# Altium schematic sheet icamlamp_evo.SchDoc
size A4
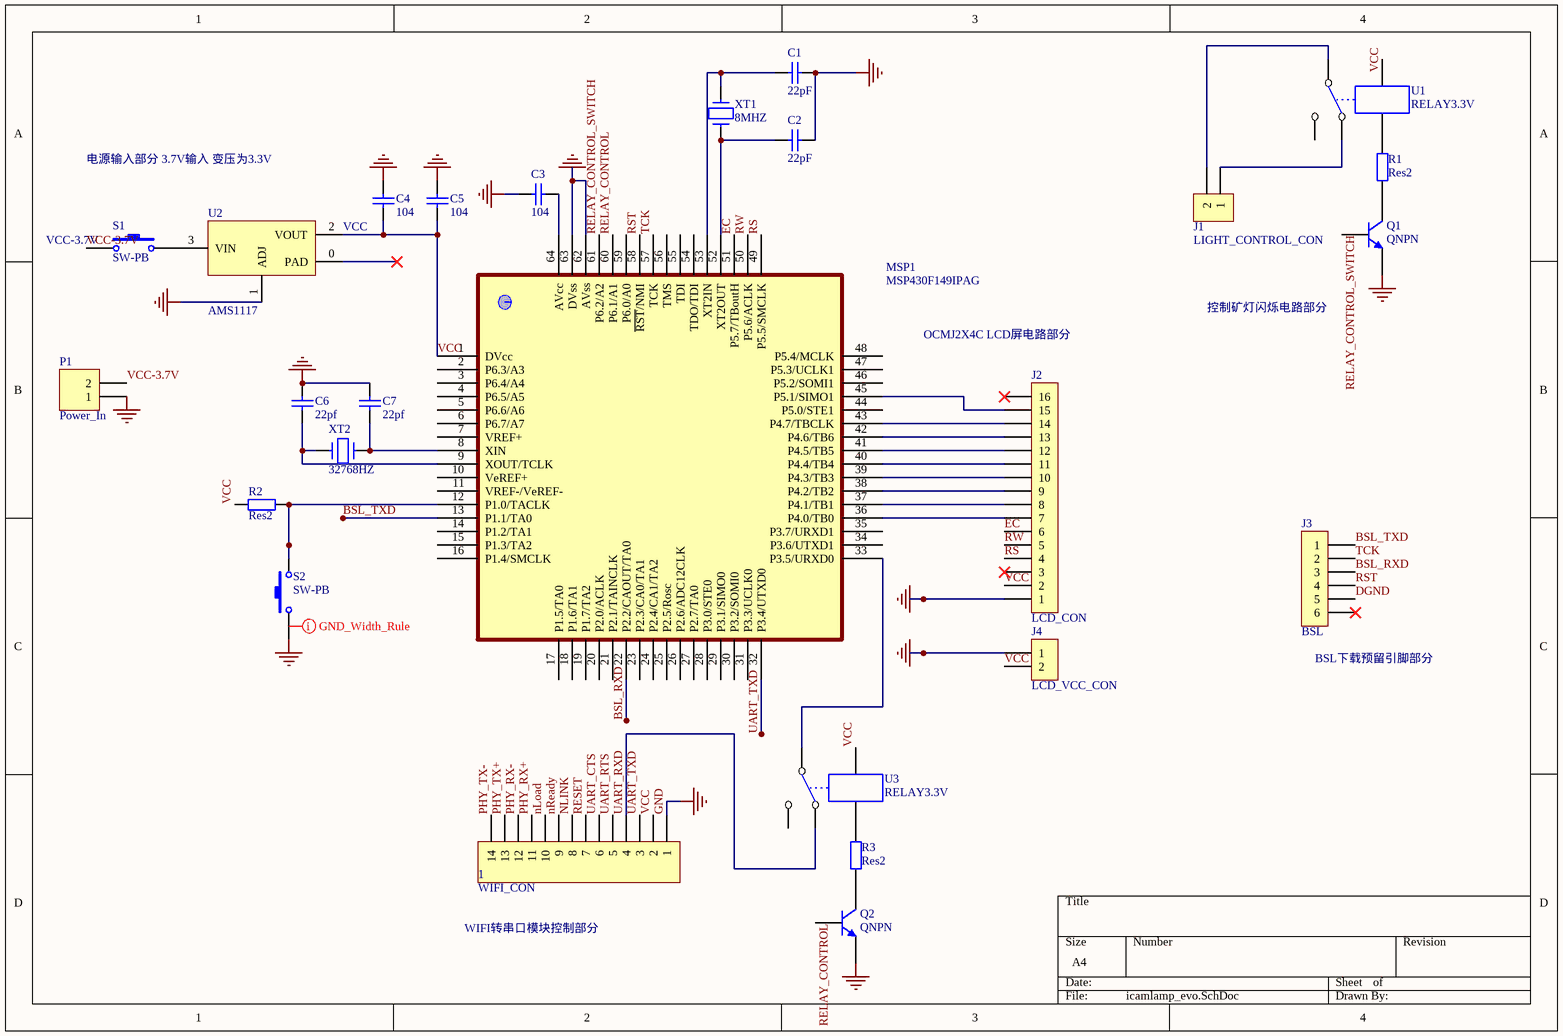
[diagram p0: icamlamp_evo.SchDoc]

## Parts
1  WIFI_CON  [wificon]
C1  22pF  [0805]
C2  22pF  [0805]
C3  104  [0805]
C4  104  [0805]
C5  104  [0805]
C6  22pf  [0805]
C7  22pf  [0805]
J1  LIGHT_CONTROL_CON  [SIP2]
J2  LCD_CON  [HDR2X8]
J3  BSL  [HDR2X3]
J4  LCD_VCC_CON  [SIP2]
MSP1  MSP430F149IPAG  [PAG]
P1  Power_In  [HDR1X2H]
Q1  QNPN  [SO-G3/C2.5]
Q2  QNPN  [SO-G3/C2.5]
R1  Res2  [0805]
R2  Res2  [0805]
R3  Res2  [0805]
S1  SW-PB  [SPST-2]
S2  SW-PB  [SPST-2]
U1  RELAY3.3V  [Relay5V]
U2  AMS1117  [SOT-223]
U3  RELAY3.3V  [Relay5V]
XT1  8MHZ  [HC-49S]
XT2  32768HZ  [AT26]

## Nets
GND: 1.1 C1.1 C2.1 C3.2 C4.1 C5.1 C6.2 C7.2 J2.1 J4.1 MSP1.62(AVss) MSP1.63(DVss) P1.1 Q1.3(E) Q2.3(E) S2.1 U2.1(ADJ)
BSL_RXD: J3.3 MSP1.22(P2.2/CAOUT/TA0)
BSL_TXD: J3.1 MSP1.13(P1.1/TA0)
DGND: J3.5
EC: J2.6 MSP1.51(P5.7/TBoutH)
NLINK: 1.8
nLoad: 1.10
nReady: 1.9
PHY_RX+: 1.11
PHY_RX-: 1.12
PHY_TX+: 1.13
PHY_TX-: 1.14
RELAY_CONTROL: MSP1.60(P6.1/A1) Q2.2(B)
RELAY_CONTROL_SWITCH: MSP1.61(P6.2/A2) Q1.2(B)
RESET: 1.7
RS: J2.4 MSP1.49(P5.5/SMCLK)
RST: J3.4 MSP1.58(~{RST}/NMI)
RW: J2.5 MSP1.50(P5.6/ACLK)
TCK: J3.2 MSP1.57(TCK)
UART_CTS: 1.6
UART_RTS: 1.5
UART_RXD: 1.4 U3.3
UART_TXD: 1.3 MSP1.32(P3.4/UTXD0)
VCC: 1.2 C4.2 C5.2 J2.2 J4.2 MSP1.1(DVcc) R2.1 U2.2(VOUT) U3.4
VCC-3.7V: P1.2 S1.1
NetC1_2: C1.2 MSP1.53(XT2IN) XT1.2
NetC2_2: C2.2 MSP1.52(XT2OUT) XT1.1
NetC3_1: C3.1 MSP1.64(AVcc)
NetC6_1: C6.1 MSP1.9(XOUT/TCLK) XT2.2
NetC7_1: C7.1 MSP1.8(XIN) XT2.1
NetJ1_1: J1.1 U1.3
NetJ1_2: J1.2 U1.1
NetJ2_7: J2.7 MSP1.36(P4.0/TB0)
NetJ2_8: J2.8 MSP1.37(P4.1/TB1)
NetJ2_9: J2.9 MSP1.38(P4.2/TB2)
NetJ2_10: J2.10 MSP1.39(P4.3/TB3)
NetJ2_11: J2.11 MSP1.40(P4.4/TB4)
NetJ2_12: J2.12 MSP1.41(P4.5/TB5)
NetJ2_13: J2.13 MSP1.42(P4.6/TB6)
NetJ2_14: J2.14 MSP1.43(P4.7/TBCLK)
NetJ2_15: J2.15 MSP1.45(P5.1/SIMO1)
NetMSP1_12: MSP1.12(P1.0/TACLK) R2.2 S2.2
NetMSP1_33: MSP1.33(P3.5/URXD0) U3.1
NetQ1_1: Q1.1(C) R1.1
NetQ2_1: Q2.1(C) R3.1
NetR1_2: R1.2 U1.5
NetR3_2: R3.2 U3.5
NetS1_2: S1.2 U2.3(VIN)

Not connected (* = marked no-connect by the designer): J2 3* 16*; J3 6*; MSP1 2(P6.3/A3) 3(P6.4/A4) 4(P6.5/A5) 5(P6.6/A6) 6(P6.7/A7) 7(VREF+) 10(VeREF+) 11(VREF-/VeREF-) 14(P1.2/TA1) 15(P1.3/TA2) 16(P1.4/SMCLK) 17(P1.5/TA0) 18(P1.6/TA1) 19(P1.7/TA2) 20(P2.0/ACLK) 21(P2.1/TAINCLK) 23(P2.3/CA0/TA1) 24(P2.4/CA1/TA2) 25(P2.5/Rosc) 26(P2.6/ADC12CLK) 27(P2.7/TA0) 28(P3.0/STE0) 29(P3.1/SIMO0) 30(P3.2/SOMI0) 31(P3.3/UCLK0) 34(P3.6/UTXD1) 35(P3.7/URXD1) 44(P5.0/STE1) 46(P5.2/SOMI1) 47(P5.3/UCLK1) 48(P5.4/MCLK) 54(TDO/TDI) 55(TDI) 56(TMS) 59(P6.0/A0); U1 2 4; U2 0(PAD)*; U3 2

## Layout directives
rule Width Constraint [Pref Width = 30mil    Min Width = 30mil    Max Width = 30mil]: (no net found under the mark)

## Notes on the sheet
- 电源输入部分 3.7V输入 变压为3.3V
- (near S1) VCC-3.7V
- VCC
- 控制矿灯闪烁电路部分
- OCMJ2X4C LCD屏电路部分
- (near J3) BSL下载预留引脚部分
- WIFI转串口模块控制部分
- Labels drawn without touching a wire or pin: VCC

## Library data of the parts
1 = CON14
C1-C7 = Cap: Capacitor; Published: 8-Jun-2000; LatestRevisionDate: 17-Jul-2002; LatestRevisionNote: Re-released for DXP Platform.; Publisher: Altium Limited
J1 J4 = CON2
J2 = CON16
J3 = CON6
P1 = Header 2H: Header, 2-Pin, Right Angle; LatestRevisionDate: 17-Jul-2002; LatestRevisionNote: Re-released for DXP Platform.; Publisher: Altium Limited
Q1 Q2 = QNPN: NPN Bipolar Transistor; Published: 8-Jun-2000; LatestRevisionDate: 17-Jul-2002; LatestRevisionNote: Re-released for DXP Platform.; PackageReference: SOT-23B; Publisher: Altium Limited; Code_JEDEC: SOT-23
R1-R3 = Res2: Resistor; Published: 8-Jun-2000; LatestRevisionDate: 17-Jul-2002; LatestRevisionNote: Re-released for DXP Platform.; Publisher: Altium Limited
S1 S2 = SW-PB: Switch; Published: 24-Mar-1999; LatestRevisionDate: 17-Jul-2002; LatestRevisionNote: Re-released for DXP Platform.; Publisher: Altium Limited
U1 U3 = RELAY5V
U2 = AMS1117: LDO ADJ
XT1 = 8MHZ: CY-49S-8MHZ
XT2 = 32768HZ: CY-AT26-32768HZ